# EAGLE design power supply5v (EAGLE 9.6.2)
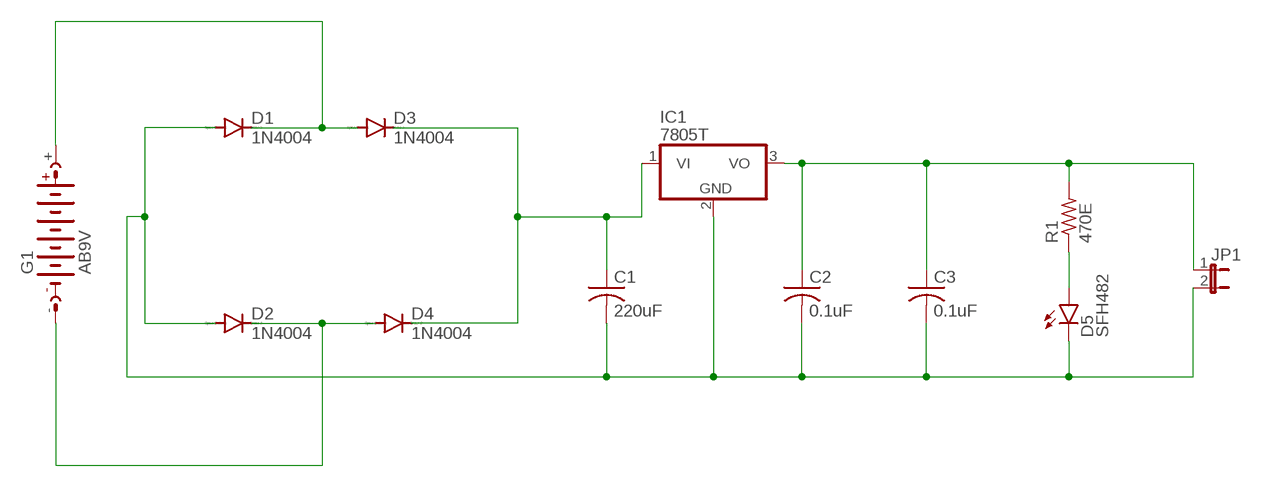
[diagram p0: schematic, sheet 1]

## Parts
C1  220uF  C-US050-024X044  [C050-024X044]
C2  0.1uF  C-US050-024X044  [C050-024X044]
C3  0.1uF  C-US050-024X044  [C050-024X044]
D1  1N4004  [DO41-10]
D2  1N4004  [DO41-10]
D3  1N4004  [DO41-10]
D4  1N4004  [DO41-10]
D5  SFH482  [SFH482]
G1  AB9V  [AB9V]
IC1  7805T  [TO220H]
JP1  JP1E  [JP1]
R1  470E  R-US_0204/7  [0204/7]

## Nets
N$1: C1.2 C2.2 C3.2 D1.A D2.A D5.K(C) IC1.2(GND) JP1.2
N$2: D1.C D3.A G1.+
N$3: D2.C D4.A G1.-
N$4: C1.1 D3.C D4.C IC1.1(VI)
N$5: C2.1 C3.1 IC1.3(VO) JP1.1 R1.2
N$6: D5.A R1.1

## Library data of the parts
C1-C3 = rcl:C-US: CAPACITOR, American symbol; SPICEPREFIX: C
D1-D4 = diode:1N4004: DIODE general purpose rectifier, 1 A
D5 = led:SFH482: IR LED infrared emitting diode, Infineon
G1 = battery:AB9V: 9-V BATTERY CLIP
IC1 = linear:78*: Positive VOLTAGE REGULATOR Source: http://cache.national.com/ds/LM/LM78L05.pdf http://www.fairchildsemi.com/ds/LM/LM7805.pdf
JP1 = jumper:JP1E: JUMPER
R1 = rcl:R-US_: RESISTOR, American symbol; SPICEPREFIX: R

## Board
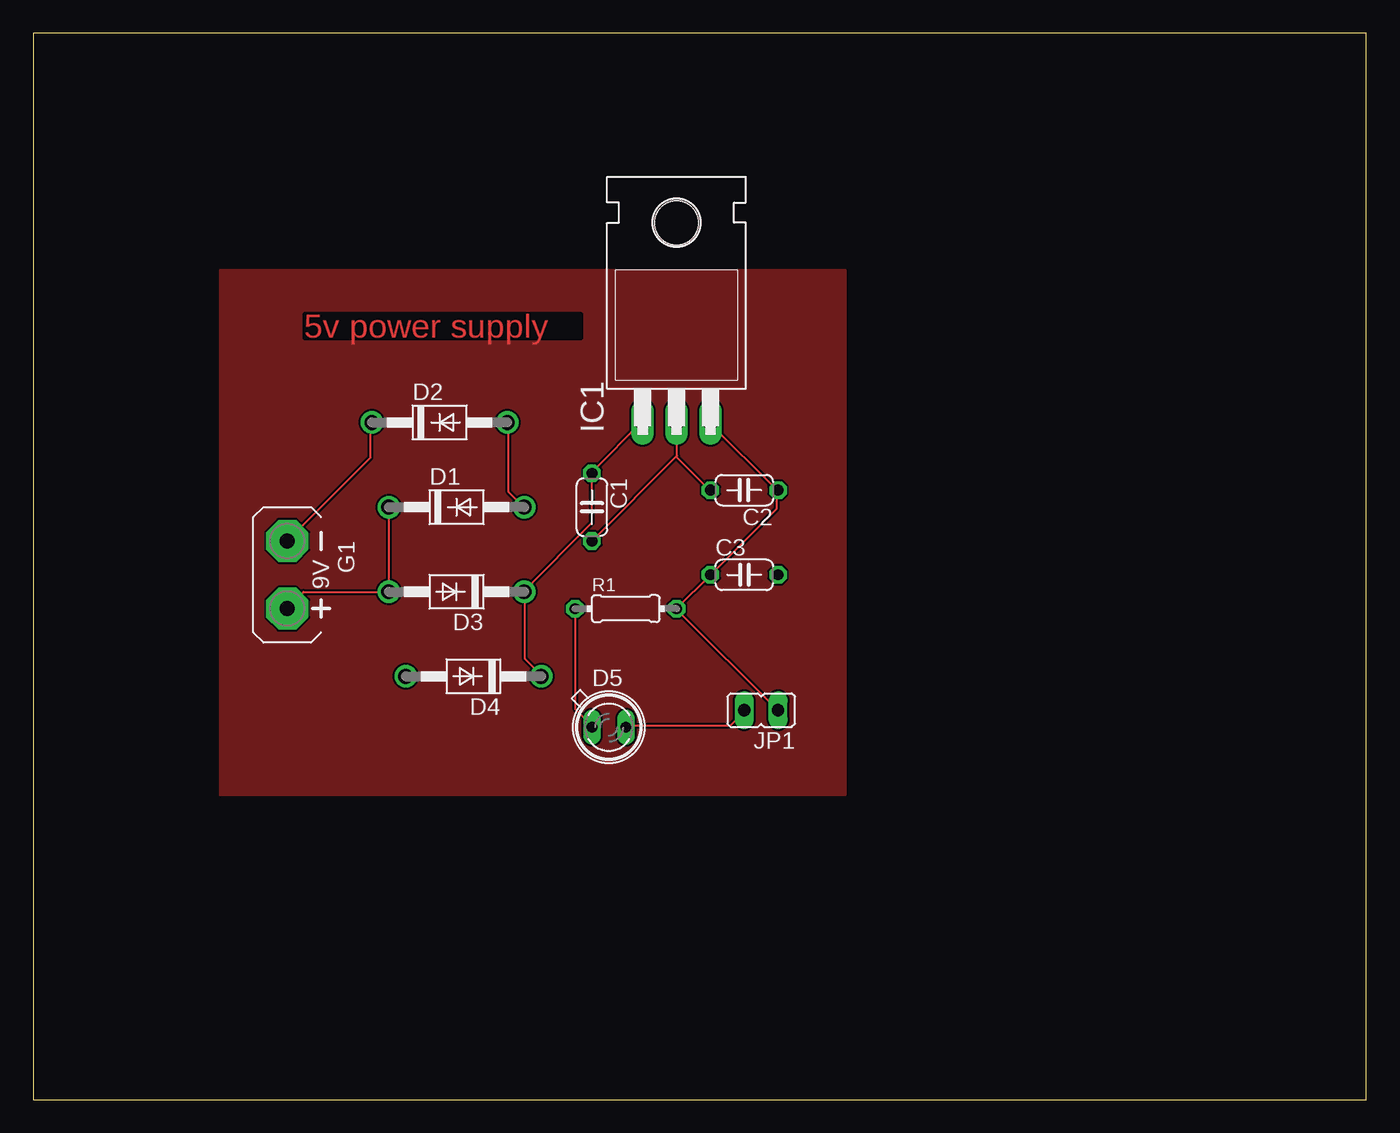
[diagram p1: board, top side]
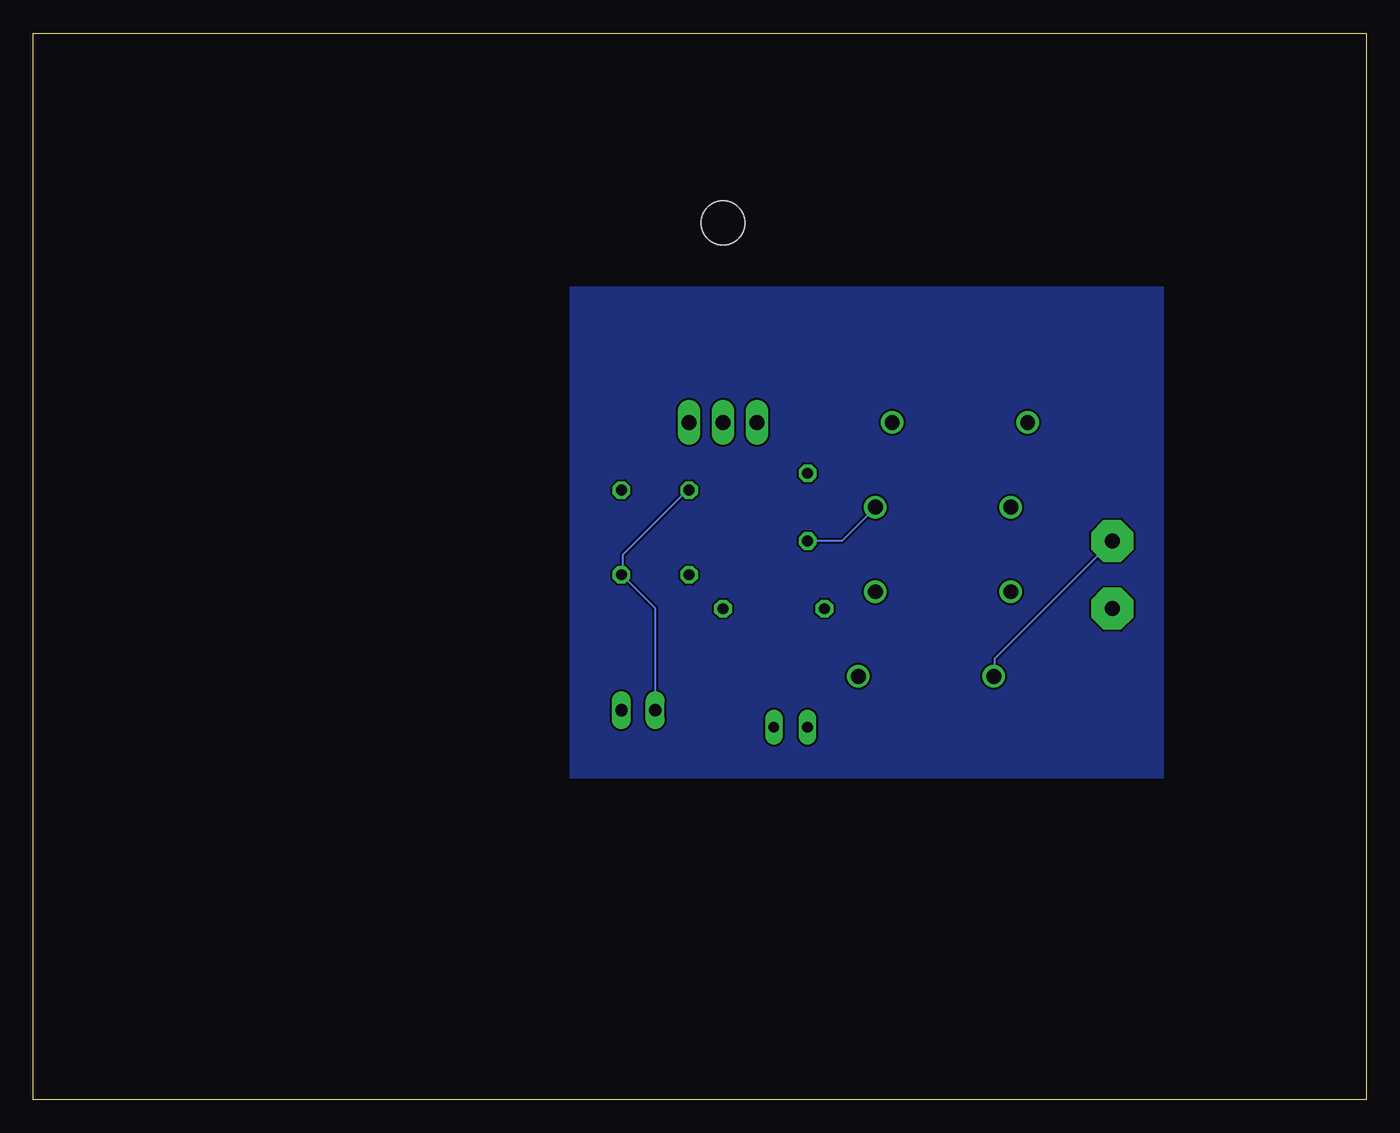
[diagram p2: board, bottom side, seen from below]

Size 100 x 80 mm. Coordinates in mm from the lower left corner, seen from the top.
Outline: 0,0 100,0 100,80 0,80 0,0
Copper layers (1*16): Top 0.035mm / dielectric 1.5mm / Bottom 0.035mm
Design rules "default": minimum track width 6mil, minimum drill 0.35mm, track to track 6mil, track to pad 6mil, pad to pad 6mil, via to via 6mil, smd to smd 6mil, copper to edge 40mil, drill to drill 6mil, minimum pad ring 10mil, minimum via ring 8mil, stop-mask expansion 4mil, vias tented up to drill 0mil, thermal gap 10mil

### Footprints (pad centres in the part's own frame; a part is rotated, then mirrored left to right if it is on the bottom)
C050-024X044 = drill 0.813 octagon: 1 -2.54,0; 2 2.54,0
DO41-10 = drill 1.118: A 5.08,0; C -5.08,0
SFH482 = drill 0.813 long: A -1.27,0; K 1.27,0
AB9V = drill 1.118 pad 3.15 octagon: + 0,2.54; - 0,-2.54
TO220H = drill 1.118 long: 1 -2.54,-10.16; 2 0,-10.16; 3 2.54,-10.16 | hole 3.302: 0,4.826
JP1 = drill 0.914 long: 1 0,-1.27; 2 0,1.27
0204/7 = drill 0.813 octagon: 1 -3.81,0; 2 3.81,0

### Placement (x,y rotation side)
C1  41.91,44.45 270 top
C2  53.34,45.72 180 top
C3  53.34,39.37 0 top
D1  31.75,44.45 0 top
D2  30.48,50.8 0 top
D3  31.75,38.1 180 top
D4  33.02,31.75 180 top
D5  43.18,27.94 0 top
G1  19.05,39.37 180 top
IC1  48.26,60.96 0 top
JP1  54.61,29.21 90 top
R1  44.45,36.83 0 top

### Tracks (layer width: path | path; a pad name or v marks a point on that pad's centre or on a via)
GND
  pour Bottom: 15.24,59.69 15.24,24.13 59.69,24.13 59.69,60.96 57.15,60.96 15.24,60.96
  pour Top: 13.97,60.96 13.97,22.86 60.96,22.86 60.96,62.23 59.69,62.23 13.97,62.23
N$1
  Top 0.152: D2.A 35.66,50.75 35.66,45.57 36.73,44.5 D1.A | D5.K 44.5,28.04 52.27,28.04 53.34,29.11 JP1.2 | 48.31,48.31 48.31,48.16 50.75,45.72 C2.2 | 48.31,48.31 48.31,50.75 IC1.2 | 48.31,48.31 C1.2
  Bottom 0.152: C1.2 39.32,41.91 36.88,44.35 D1.A | C2.2 50.9,45.72 55.78,40.84 55.78,39.47 C3.2 55.78,39.32 53.34,36.88 JP1.2
N$2
  Top 0.152: D1.C D3.A 20.27,38.1 19.05,36.88 G1.+
N$3
  Top 0.152: G1.- 25.3,48.16 25.3,50.75 D2.C
  Bottom 0.152: G1.- 27.89,33.07 27.89,31.85 D4.A
N$4
  Top 0.152: IC1.1 45.72,50.9 41.91,47.09 C1.1 41.91,43.28 36.73,38.1 D3.C 36.88,38.1 36.88,33.07 38.1,31.85 D4.C
N$5
  Top 0.152: 55.78,45.72 50.75,50.75 IC1.3 | JP1.1 55.78,29.26 48.31,36.73 R1.2 C3.1 55.78,44.35 55.78,45.72 | 55.78,45.72 C2.1
N$6
  Top 0.152: R1.1 40.69,36.73 40.69,29.26 41.91,28.04 D5.A

### Text on the board
Top: 5v power supply